# EAGLE design V1_7_7 (EAGLE 8.3.2)
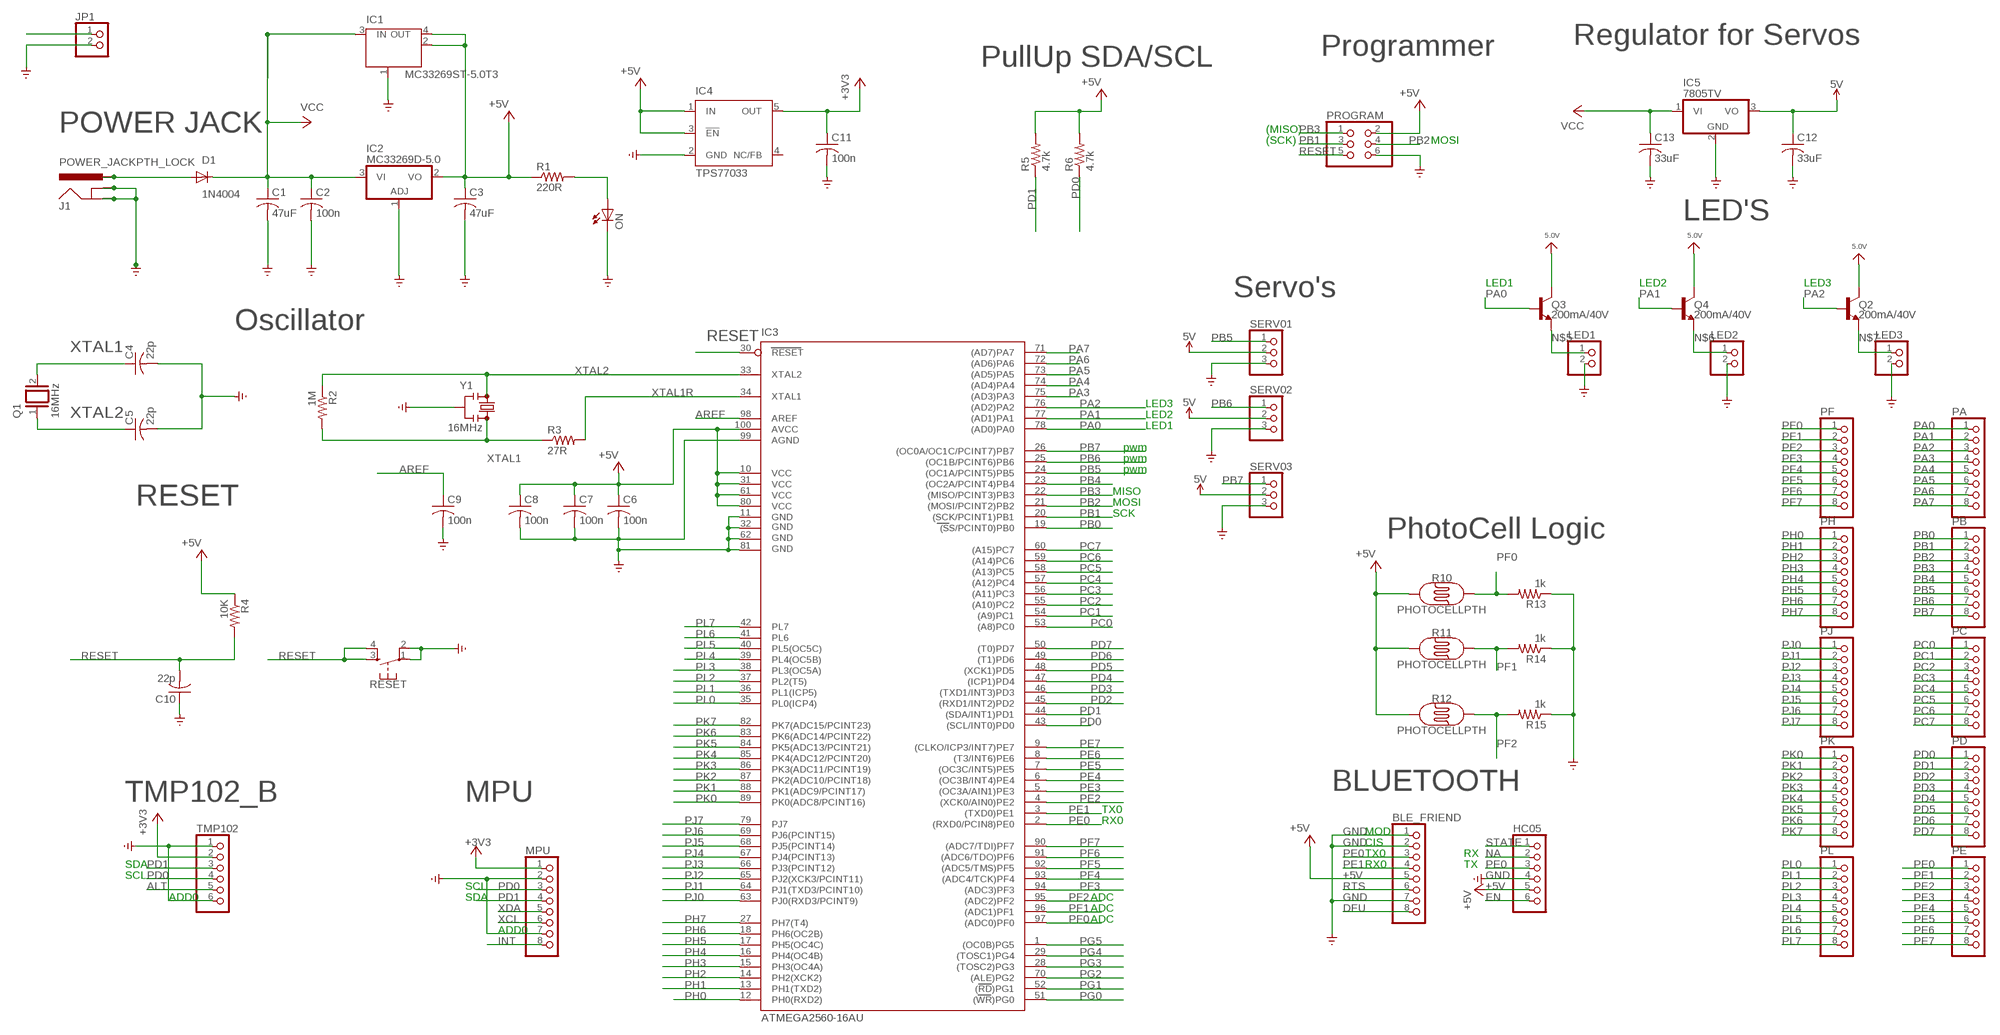
[diagram p0: schematic, sheet 1, part 1 of 2]
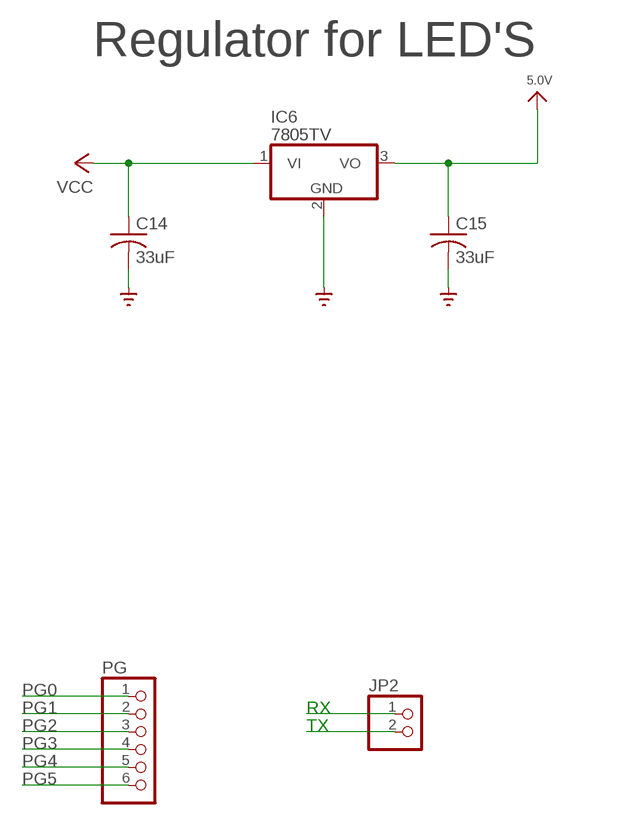
[diagram p1: schematic, sheet 1, part 2 of 2]

## Parts
BLE_FRIEND  PINHD-1X8  [1X08]
C1  47uF  C-US025-024X044  [C025-024X044]
C2  100n  C-US025-024X044  [C025-024X044]
C3  47uF  C-US025-024X044  [C025-024X044]
C4  22p  C-US025-024X044  [C025-024X044]
C5  22p  C-US025-024X044  [C025-024X044]
C6  100n  C-US025-024X044  [C025-024X044]
C7  100n  C-US025-024X044  [C025-024X044]
C8  100n  C-US025-024X044  [C025-024X044]
C9  100n  C-US025-024X044  [C025-024X044]
C10  22p  C-US025-024X044  [C025-024X044]
C11  100n  C-US025-024X044  [C025-024X044]
C12  33uF  C-US025-024X044  [C025-024X044]
C13  33uF  C-US025-024X044  [C025-024X044]
C14  33uF  C-US025-024X044  [C025-024X044]
C15  33uF  C-US025-024X044  [C025-024X044]
D1  1N4004  [DO41-10]
HC05  PINHD-1X6  [1X06]
IC1  MC33269ST-5.0T3  MC33269ST-3.3T3  [SOT223]
IC2  MC33269D-5.0  [DPACK]
IC3  ATMEGA2560-16AU  [TQFP100]
IC4  TPS77033  [SOT23-DBV]
IC5  7805TV  [TO220V]
IC6  7805TV  [TO220V]
J1  POWER_JACKPTH_LOCK  [POWER_JACK_PTH_LOCK]
JP1  PINHD-1X2  [1X02]
JP2  PINHD-1X2  [1X02]
LED1  PINHD-1X2  [1X02]
LED2  PINHD-1X2  [1X02]
LED3  PINHD-1X2  [1X02]
MPU  PINHD-1X8  [1X08]
ON  LED3MM  [LED3MM]
PA  PINHD-1X8  [1X08]
PB  PINHD-1X8  [1X08]
PC  PINHD-1X8  [1X08]
PD  PINHD-1X8  [1X08]
PE  PINHD-1X8  [1X08]
PF  PINHD-1X8  [1X08]
PG  PINHD-1X6  [1X06]
PH  PINHD-1X8  [1X08]
PJ  PINHD-1X8  [1X08]
PK  PINHD-1X8  [1X08]
PL  PINHD-1X8  [1X08]
PROGRAM  PINHD-2X3  [2X03]
Q1  16MHz  XTAL/S  [QS]
Q2  200mA/40V  TRANS_NPN-2N3904  [TO-92]
Q3  200mA/40V  TRANS_NPN-2N3904  [TO-92]
Q4  200mA/40V  TRANS_NPN-2N3904  [TO-92]
R1  220R  R-US_0204/2V  [0204V]
R2  1M  R-US_0204/2V  [0204V]
R3  27R  R-US_0204/2V  [0204V]
R4  10K  R-US_0204/2V  [0204V]
R5  4.7k  R-US_0204/2V  [0204V]
R6  4.7k  R-US_0204/2V  [0204V]
R10  PHOTOCELLPTH  [PHOTOCELL]
R11  PHOTOCELLPTH  [PHOTOCELL]
R12  PHOTOCELLPTH  [PHOTOCELL]
R13  1k  R-US_0204/2V  [0204V]
R14  1k  R-US_0204/2V  [0204V]
R15  1k  R-US_0204/2V  [0204V]
RESET  MOMENTARY-SWITCH-SPST-2-SMD-5.2MM  [TACTILE_SWITCH_SMD_5.2MM]
SERV01  PINHD-1X3  [1X03]
SERV02  PINHD-1X3  [1X03]
SERV03  PINHD-1X3  [1X03]
TMP102  PINHD-1X6  [1X06]
Y1  16MHz  RESONATORSMD-3.2X1.3  [RESONATOR-SMD-3.2X1.3]

## Nets
5.0V: C15.1 IC6.3(VO) Q2.3(C) Q3.3(C) Q4.3(C)
5V: C12.1 IC5.3(VO) SERV01.2 SERV02.2 SERV03.2
+3V3: C11.1 IC4.5(OUT) MPU.1 TMP102.2
+5V: BLE_FRIEND.5 C3.1 C6.1 C7.1 C8.1 HC05.5 IC1.2(OUT) IC1.4(OUT) IC2.2(VO) IC3.10(VCC) IC3.31(VCC1) IC3.61(VCC2) IC3.80(VCC3) IC3.100(AVCC) IC4.1(IN) IC4.3(!EN) PROGRAM.2 R1.1 R4.1 R5.2 R6.2 R10.1 R11.1 R12.1
ALT: TMP102.5
AREF: C9.1 IC3.98(AREF)
DFU: BLE_FRIEND.8
EN: HC05.6
GND: BLE_FRIEND.1 BLE_FRIEND.2 BLE_FRIEND.7 C1.2 C2.2 C3.2 C4.2 C5.2 C6.2 C7.2 C8.2 C9.2 C10.1 C11.2 C12.2 C13.2 C14.2 C15.2 HC05.4 IC1.1(GND/ADJ) IC2.1(ADJ) IC3.11(GND) IC3.32(GND1) IC3.62(GND2) IC3.81(GND3) IC3.99(AGND) IC4.2(GND) IC5.2(GND) IC6.2(GND) J1.GND J1.GNDBREAK JP1.2 LED1.2 LED2.2 LED3.2 MPU.2 MPU.7 ON.K(C) PROGRAM.6 R13.1 R14.1 R15.1 RESET.1 RESET.2 SERV01.3 SERV02.3 SERV03.3 TMP102.1 TMP102.6 Y1.2 ; supply symbol labelled GND_
INT: MPU.8
N$3: ON.A R1.2
N$5: LED1.1 Q3.1(E)
N$6: LED2.1 Q4.1(E)
N$7: LED3.1 Q2.1(E)
NA: HC05.2
PA0: IC3.78((AD0)PA0) PA.1 Q3.2(B)
PA1: IC3.77((AD1)PA1) PA.2 Q4.2(B)
PA2: IC3.76((AD2)PA2) PA.3 Q2.2(B)
PA3: IC3.75((AD3)PA3) PA.4
PA4: IC3.74((AD4)PA4) PA.5
PA5: IC3.73((AD5)PA5) PA.6
PA6: IC3.72((AD6)PA6) PA.7
PA7: IC3.71((AD7)PA7) PA.8
PB0: IC3.19((SS/PCINT0)PB0) PB.1
PB1: IC3.20((SCK/PCINT1)PB1) PB.2 PROGRAM.3
PB2: IC3.21((MOSI/PCINT2)PB2) PB.3 PROGRAM.4
PB3: IC3.22((MISO/PCINT3)PB3) PB.4 PROGRAM.1
PB4: IC3.23((OC2A/PCINT4)PB4) PB.5
PB5: IC3.24((OC1A/PCINT5)PB5) PB.6 SERV01.1
PB6: IC3.25((OC1B/PCINT6)PB6) PB.7 SERV02.1
PB7: IC3.26((OC0A/OC1C/PCINT7)PB7) PB.8 SERV03.1
PC0: IC3.53((A8)PC0) PC.1
PC1: IC3.54((A9)PC1) PC.2
PC2: IC3.55((A10)PC2) PC.3
PC3: IC3.56((A11)PC3) PC.4
PC4: IC3.57((A12)PC4) PC.5
PC5: IC3.58((A13)PC5) PC.6
PC6: IC3.59((A14)PC6) PC.7
PC7: IC3.60((A15)PC7) PC.8
PD0: IC3.43((SCL/INT0)PD0) MPU.3 PD.1 R6.1 TMP102.4
PD1: IC3.44((SDA/INT1)PD1) MPU.4 PD.2 R5.1 TMP102.3
PD2: IC3.45((RXD1/INT2)PD2) PD.3
PD3: IC3.46((TXD1/INT3)PD3) PD.4
PD4: IC3.47((ICP1)PD4) PD.5
PD5: IC3.48((XCK1)PD5) PD.6
PD6: IC3.49((T1)PD6) PD.7
PD7: IC3.50((T0)PD7) PD.8
PE0: BLE_FRIEND.3 HC05.3 IC3.2((RXD0/PCIN8)PE0) JP2.1 PE.1
PE1: BLE_FRIEND.4 IC3.3((TXD0)PE1) JP2.2 PE.2
PE2: IC3.4((XCK0/AIN0)PE2) PE.3
PE3: IC3.5((OC3A/AIN1)PE3) PE.4
PE4: IC3.6((OC3B/INT4)PE4) PE.5
PE5: IC3.7((OC3C/INT5)PE5) PE.6
PE6: IC3.8((T3/INT6)PE6) PE.7
PE7: IC3.9((CLKO/ICP3/INT7)PE7) PE.8
PF0: IC3.97((ADC0)PF0) PF.1 R10.2 R13.2
PF1: IC3.96((ADC1)PF1) PF.2 R11.2 R14.2
PF2: IC3.95((ADC2)PF2) PF.3 R12.2 R15.2
PF3: IC3.94((ADC3)PF3) PF.4
PF4: IC3.93((ADC4/TCK)PF4) PF.5
PF5: IC3.92((ADC5/TMS)PF5) PF.6
PF6: IC3.91((ADC6/TDO)PF6) PF.7
PF7: IC3.90((ADC7/TDI)PF7) PF.8
PG0: IC3.51((WR)PG0) PG.1
PG1: IC3.52((RD)PG1) PG.2
PG2: IC3.70((ALE)PG2) PG.3
PG3: IC3.28((TOSC2)PG3) PG.4
PG4: IC3.29((TOSC1)PG4) PG.5
PG5: IC3.1((OC0B)PG5) PG.6
PH0: IC3.12(PH0(RXD2)) PH.1
PH1: IC3.13(PH1(TXD2)) PH.2
PH2: IC3.14(PH2(XCK2)) PH.3
PH3: IC3.15(PH3(OC4A)) PH.4
PH4: IC3.16(PH4(OC4B)) PH.5
PH5: IC3.17(PH5(OC4C)) PH.6
PH6: IC3.18(PH6(OC2B)) PH.7
PH7: IC3.27(PH7(T4)) PH.8
PJ0: IC3.63(PJ0(RXD3/PCINT9)) PJ.1
PJ1: IC3.64(PJ1(TXD3/PCINT10)) PJ.2
PJ2: IC3.65(PJ2(XCK3/PCINT11)) PJ.3
PJ3: IC3.66(PJ3(PCINT12)) PJ.4
PJ4: IC3.67(PJ4(PCINT13)) PJ.5
PJ5: IC3.68(PJ5(PCINT14)) PJ.6
PJ6: IC3.69(PJ6(PCINT15)) PJ.7
PJ7: IC3.79(PJ7) PJ.8
PK0: IC3.89(PK0(ADC8/PCINT16)) PK.1
PK1: IC3.88(PK1(ADC9/PCINT17)) PK.2
PK2: IC3.87(PK2(ADC10/PCINT18)) PK.3
PK3: IC3.86(PK3(ADC11/PCINT19)) PK.4
PK4: IC3.85(PK4(ADC12/PCINT20)) PK.5
PK5: IC3.84(PK5(ADC13/PCINT21)) PK.6
PK6: IC3.83(PK6(ADC14/PCINT22)) PK.7
PK7: IC3.82(PK7(ADC15/PCINT23)) PK.8
PL0: IC3.35(PL0(ICP4)) PL.1
PL1: IC3.36(PL1(ICP5)) PL.2
PL2: IC3.37(PL2(T5)) PL.3
PL3: IC3.38(PL3(OC5A)) PL.4
PL4: IC3.39(PL4(OC5B)) PL.5
PL5: IC3.40(PL5(OC5C)) PL.6
PL6: IC3.41(PL6) PL.7
PL7: IC3.42(PL7) PL.8
POWERIN: D1.A J1.PWR JP1.1
RESET: C10.2 IC3.30(RESET) PROGRAM.5 R4.2 RESET.3 RESET.4
RTS: BLE_FRIEND.6
STATE: HC05.1
VCC: C1.1 C2.1 C13.1 C14.1 D1.C IC1.3(IN) IC2.3(VI) IC5.1(VI) IC6.1(VI)
XCL: MPU.6
XDA: MPU.5
XTAL1: C4.1 Q1.2 R2.2 R3.1 Y1.3
XTAL1R: IC3.34(XTAL1) R3.2
XTAL2: C5.1 IC3.33(XTAL2) Q1.1 R2.1 Y1.1
Unconnected: IC4.4(NC/FB)

## Notes on the sheet
- Regulator for Servos | Regulator for LED'S
- Programmer
- PullUp SDA/SCL
- POWER JACK | (MISO)
- (SCK) | MOSI
- LED'S
- LED1 | LED2 | LED3
- Servo's
- Oscillator
- LED3
- LED2
- LED1
- pwm | RX
- pwm | TX
- pwm
- MISO
- RESET | MOSI
- SCK
- PhotoCell Logic
- BLUETOOTH
- TMP102_B | MPU
- TX0
- RX0
- MOD
- CIS
- TX0 | RX
- SDA | RX0 | TX
- SCL
- SCL
- ADD0 | SDA | ADC
- ADC
- ADC
- ADD0

## Library data of the parts
BLE_FRIEND MPU PA PB PC PD PE PF PH PJ PK PL = pinhead:PINHD-1X8: PIN HEADER
C1-C15 = adafruit:C-US: CAPACITOR, American symbol
D1 = adafruit:1N4004: DIODE General purpose 1N400x type rectifier (With bigger pads) http://www.ladyada.net/library/pcb/eaglelibrary.html
HC05 = pinhead@1:PINHD-1X6: PIN HEADER
IC1 = linear:MC33269ST*: Adjustable Output Low Dropout Voltage Regulator 800 mA Source: http://www.onsemi.com/pub/Collateral/MC33269-D.PDF
IC2 = linear:MC33269?*: Adjustable Output Low Dropout Voltage Regulator 800 mA Source: http://www.onsemi.com/pub/Collateral/MC33269-D.PDF
IC3 = atmel-2005:ATMEGA*: MICROCONTROLLER 64/128/256 Kbytes FLASH 4 Kbytes EEPROM 8 Kbytes SRAM 86 General Purpose I/O pins 12-channels16-bit PWM 4 x Serial USARTs 16-channels 10-bit A/D
IC4 = texas:TPS770*: ULTRALOW-POWER 50-mA LOW-DROPOUT LINEAR REGULATORS 50-mA Low-Dropout Regulator Source: http://focus.ti.com/lit/ds/symlink/tps77001.pdf; MF: TEXAS INSTRUMENTS; MPN: TPS77033DBVT; OC_FARNELL: 8461570; OC_NEWARK: 77C1187
IC5 IC6 = linear:78*: Positive VOLTAGE REGULATOR Source: http://cache.national.com/ds/LM/LM78L05.pdf http://www.fairchildsemi.com/ds/LM/LM7805.pdf
J1 = SparkFun-Connectors:POWER_JACK: Power Jack Connector This is the standard 5.5mm barrel jack for power. The PTH is the most common, proven, reliable, footprint. The Slot footprint only works if the mill layer is transmitted to the PCB fab house so be warned. Here are the connectors we sell at SparkFun: DC Barrel Power Jack/Connector <https://www.sparkfun.com/products/119> (PRT-00119) DC Barrel Power Jack/Connector (SMD) <https://www.sparkfun.com/products/12748> (PRT-12748) DC Barrel Jack Adapter - Breadboard Compatible <https://www.sparkfun.com/products/10811> (PRT-10811) It is used on this SparkFun product (and many, many others): SparkFun RedBoard - Programmed with Arduino <https://www.sparkfun.com/products/12757> (DEV-12757) Also, if you need a mating power supply or connector, please check these out: Wall Adapter Power Supply - 9VDC 650mA <https://www.sparkfun.com/products/298> (TOL-00298) DC Barrel Jack Adapter - Male <https://www.sparkfun.com/products/10287> (PRT-10287); PROD_ID: CONN-08197; SF_ID: PRT-00119
JP1 LED1-LED3 = pinhead:PINHD-1X2: PIN HEADER
JP2 = pinhead@1:PINHD-1X2: PIN HEADER
ON = adafruit:LED: LED OSRAM: - CHIPLED LG R971, LG N971, LY N971, LG Q971, LY Q971, LO R971, LY R971 LH N974, LH R974 LS Q976, LO Q976, LY Q976 LO Q996 - Hyper CHIPLED LW Q18S LB Q993, LB Q99A, LB R99A - SideLED LS A670, LO A670, LY A670, LG A670, LP A670 LB A673, LV A673, LT A673, LW A673 LH A674 LY A675 LS A676, LA A676, LO A676, LY A676, LW A676 LS A679, LY A679, LG A679 - Hyper Micro SIDELED® LS Y876, LA Y876, LO Y876, LY Y876 LT Y87S - SmartLED LW L88C, LW L88S LB L89C, LB L89S, LG L890 LS L89K, LO L89K, LY L89K LS L896, LA L896, LO L896, LY L896 - TOPLED LS T670, LO T670, LY T670, LG T670, LP T670 LSG T670, LSP T670, LSY T670, LOP T670, LYG T670 LG T671, LOG T671, LSG T671 LB T673, LV T673, LT T673, LW T673 LH T674 LS T676, LA T676, LO T676, LY T676, LB T676, LH T676, LSB T676, LW T676 LB T67C, LV T67C, LT T67C, LS T67K, LO T67K, LY T67K, LW E67C LS E67B, LA E67B, LO E67B, LY E67B, LB E67C, LV E67C, LT E67C LW T67C LS T679, LY T679, LG T679 LS T770, LO T770, LY T770, LG T770, LP T770 LB T773, LV T773, LT T773, LW T773 LH T774 LS E675, LA E675, LY E675, LS T675 LS T776, LA T776, LO T776, LY T776, LB T776 LHGB T686 LT T68C, LB T68C - Hyper Mini TOPLED® LB M676 - Mini TOPLED Santana® LG M470 LS M47K, LO M47K, LY M47K Source: http://www.osram.convergy.de/
PG TMP102 = pinhead:PINHD-1X6: PIN HEADER
PROGRAM = pinhead:PINHD-2X3: PIN HEADER
Q1 = special:XTAL/S: CRYSTAL
Q2-Q4 = SparkFun-DiscreteSemi:TRANS_NPN: NPN transistor Current controlled devices typically used to amplify current or used as a switch. BC547 - COM-08928 <http://www.sparkfun.com/products/8928> (TO-92 45V 100mA) (1.Collector 2.Base 3.Emitter) 2N3904 - COM-00521 <http://www.sparkfun.com/products/521> (TO-92 40V 200mA) (1.Emitter 2.Base 3.Collector) P2N2222A - COM-12852 <http://www.sparkfun.com/products/12852> (TO-92 40V 600mA) (1.Collector 2.Base 3.Emitter); PROD_ID: TRANS-08447
R1-R6 R13-R15 = resistor:R-US_: RESISTOR, American symbol
R10-R12 = SparkFun-Sensors:PHOTOCELL: Photocell (Photodetector, Photo Resistor, CdS) This is a very small light sensor. A photocell changes (also called a photodetector, photo resistor, CdS or photoconductive cell) resistance depending on the amount of light it is exposed to. These little sensors make great ambient light triggers (when light in the room turns on, do something). Datasheet <http://cdn.sparkfun.com/datasheets/Sensors/LightImaging/SEN-09088.pdf> SparkFun Products Mini Photocell <https://www.sparkfun.com/products/9088> (SEN-09088); PROD_ID: COMP-09129; SF_ID: SEN-09088
RESET = SparkFun-Switches:MOMENTARY-SWITCH-SPST-2: Momentary Switch (Pushbutton) - SPST - Two Circuits Normally-open (NO) SPST momentary switches (buttons, pushbuttons). Schematic symbol includes two switch circuits. Variants SMD-4.6MMX2.8MM - 4.60mm x 2.80mm Tactile Momentary Button Switch - Used on SparkFun SAMD21 Mini Breakout <https://www.sparkfun.com/products/13664> SMD-5.2MM - Mini Pushbutton Switch - SMD <https://www.sparkfun.com/products/8720> - Used on Arduino Pro Mini <https://www.sparkfun.com/products/11114>; PROD_ID: SWCH-08247; SF_SKU: COM-08720
SERV01-SERV03 = pinhead:PINHD-1X3: PIN HEADER
Y1 = SparkFun-Clocks:RESONATOR: Resonators (Generic) Ceramic resonators are clock-generating components, often used to control timing in microcontrollers. They usually have 3 pins: two pins for oscillation, and one pin for ground. Compared to crystals, resonators have worse tolerance, but are usually much cheaper. Plus, they have built-in load capacitors! These devices are used on boards like the Arduino Pro 8MHz <https://www.sparkfun.com/products/11114> and Arduino Pro 16MHz <https://www.sparkfun.com/products/11113>.

## Net classes
0 default: width 0.15 mm, drill 0.3 mm, clearance 0.15 mm

## Board
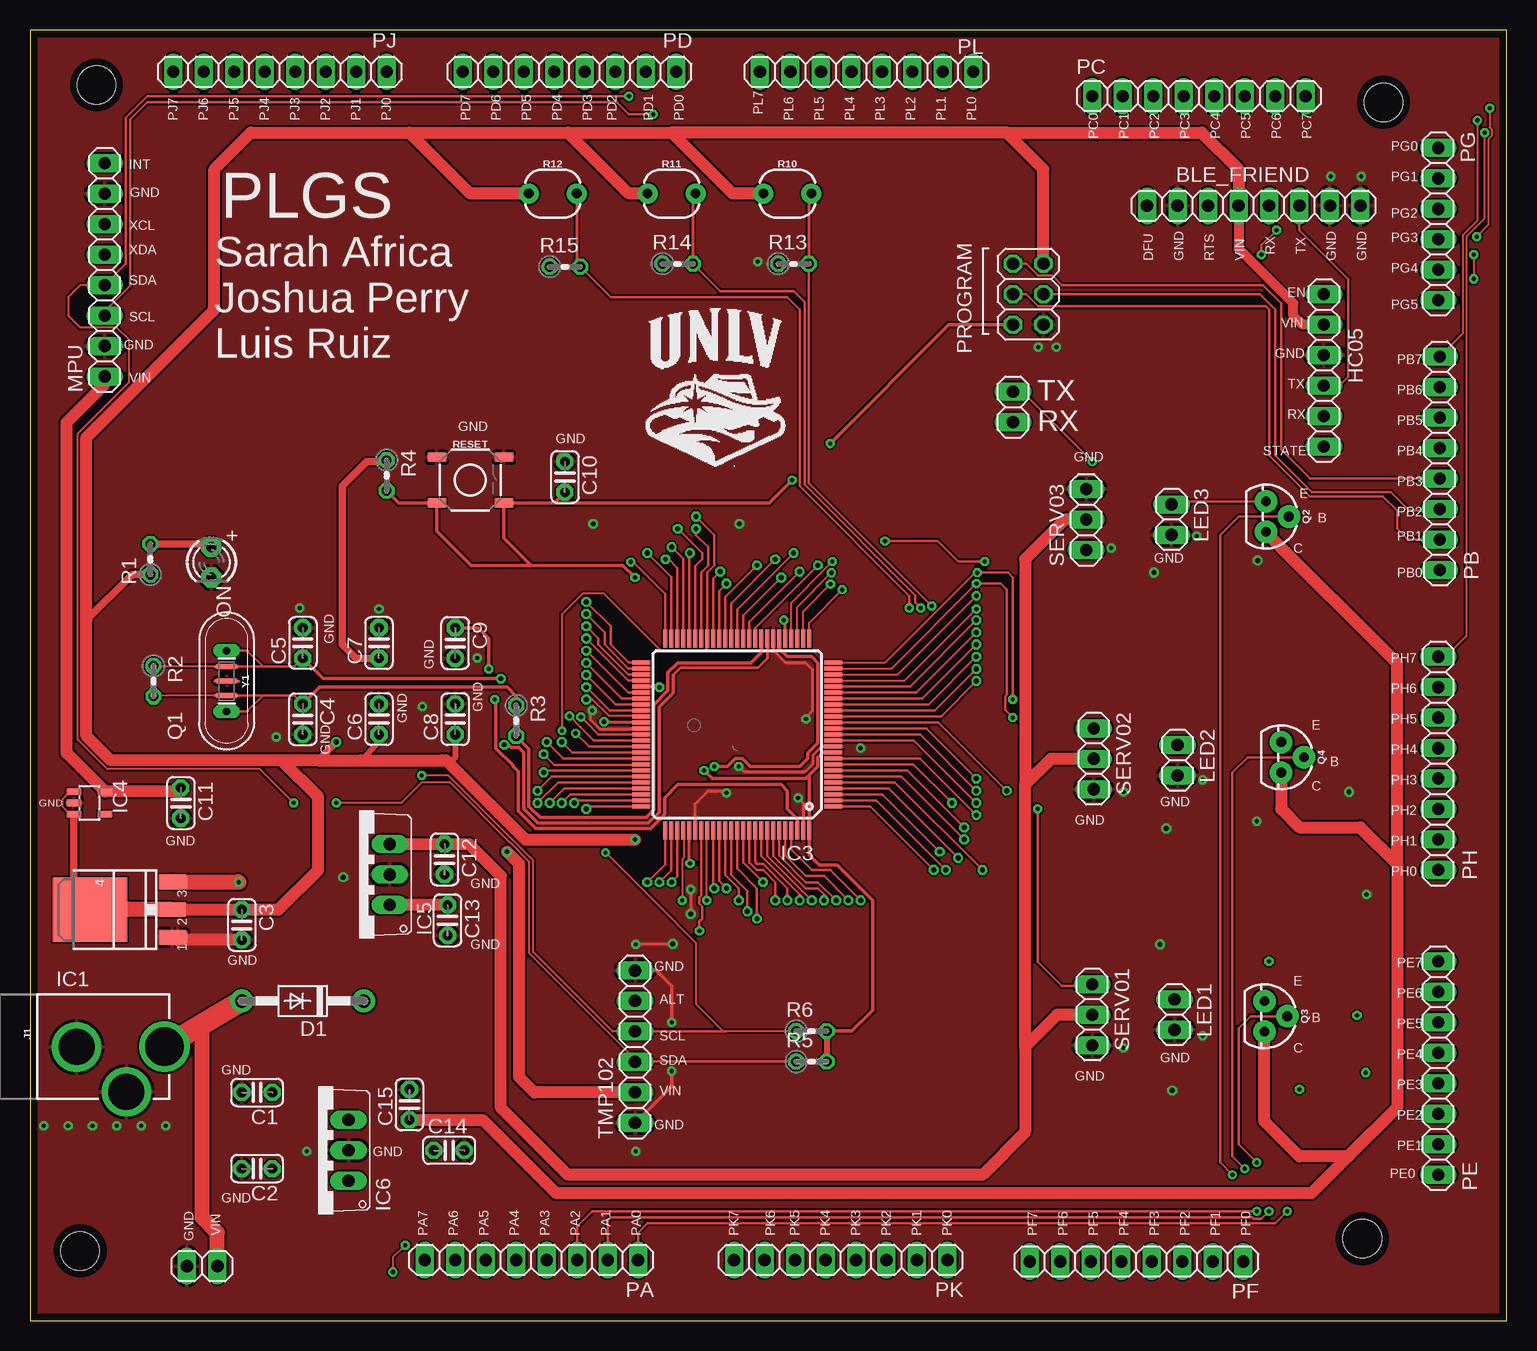
[diagram p2: board, top side]
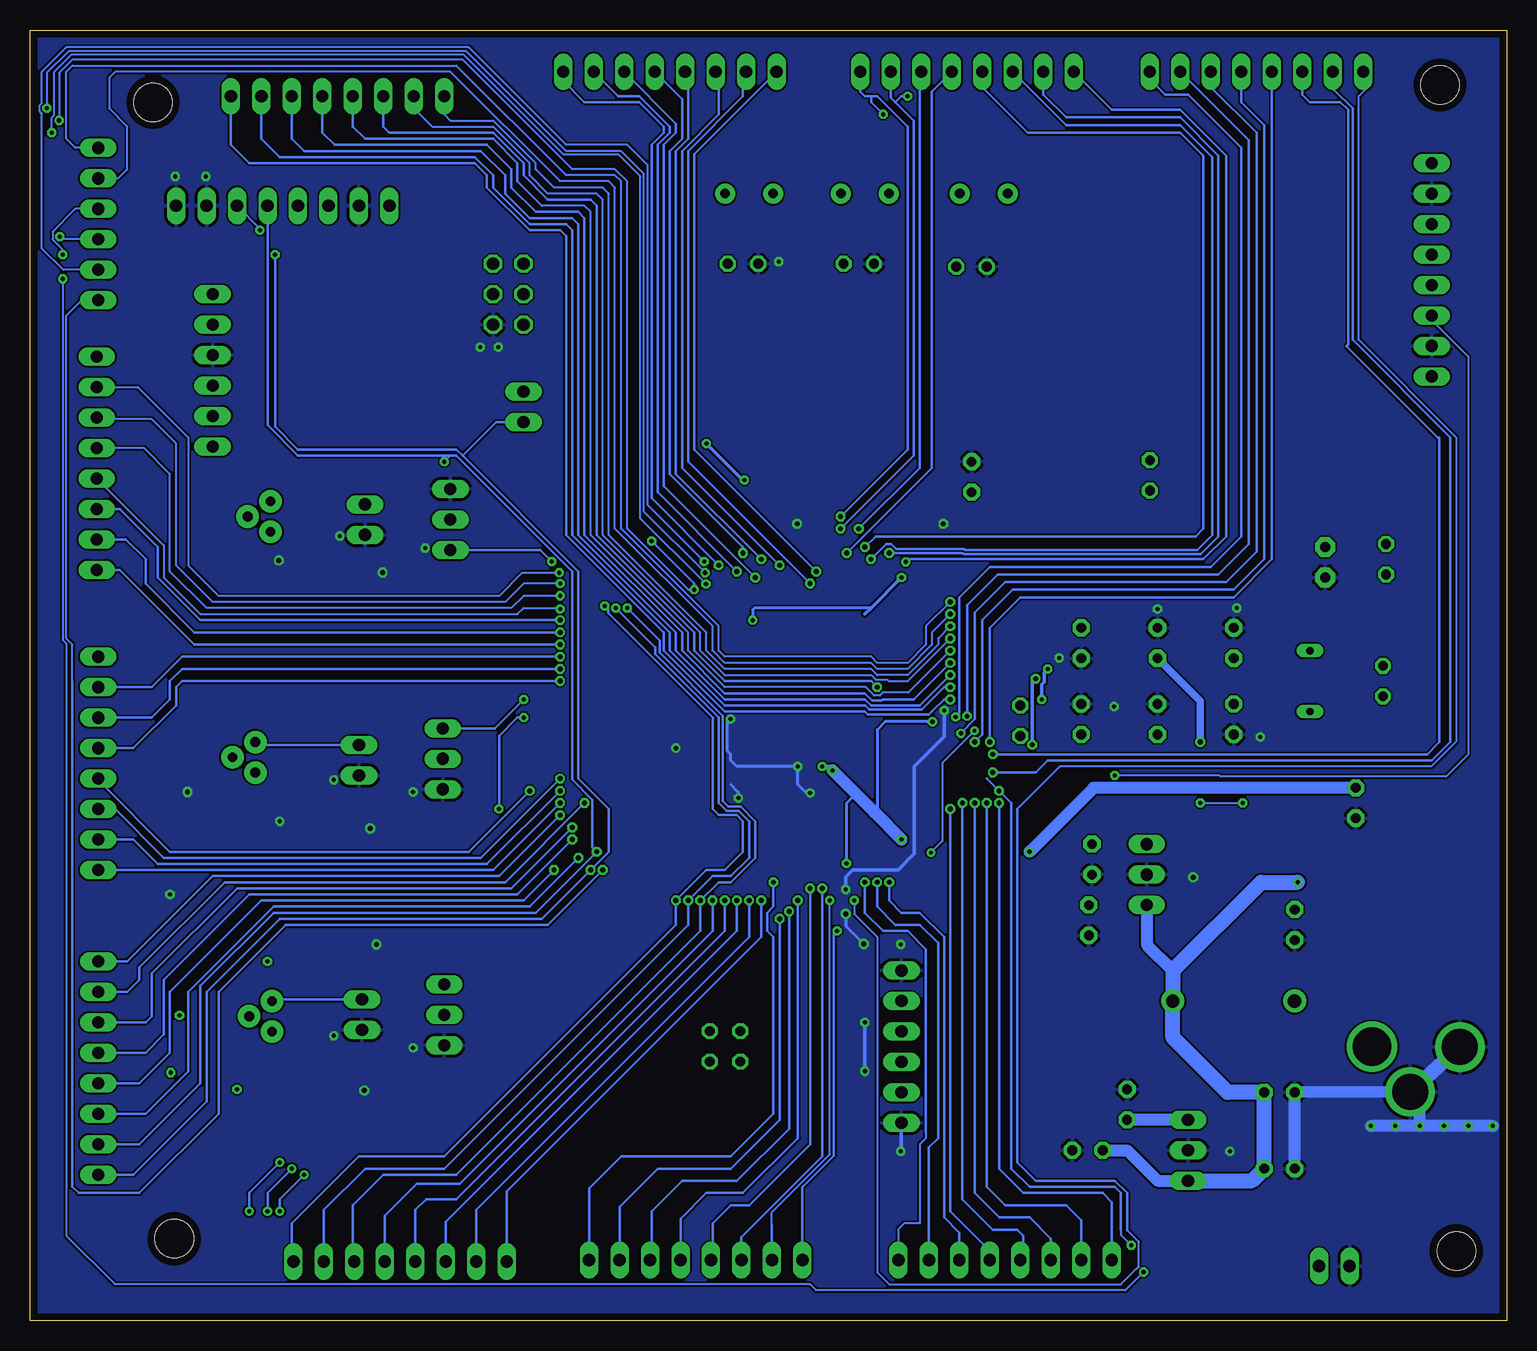
[diagram p3: board, bottom side, seen from below]

Size 123.04 x 107.62 mm. Coordinates in mm from the lower left corner, seen from the top.
Outline: 0,0 123.04,0 123.04,107.62 0,107.62 0,0
Copper layers (1*16): Top 0.035mm / dielectric 1.5mm / Bottom 0.035mm
Design rules "default *": minimum track width 0.15mm, minimum drill 0.3mm, track to track 0.15mm, track to pad 0.15mm, pad to pad 0.15mm, via to via 0.15mm, smd to smd 0.15mm, copper to edge 0.6mm, drill to drill 0.3mm, minimum pad ring 10mil, minimum via ring 8mil, stop-mask expansion 2mil, vias tented up to drill 0mil, thermal gap 10mil
Holes 3.2 mm at 5.54,103.03 112.8,101.59 111.02,6.86 4.18,5.84

### Footprints (pad centres in the part's own frame; a part is rotated, then mirrored left to right if it is on the bottom)
1X08 = drill 1.016 long: 1 -8.89,0; 2 -6.35,0; 3 -3.81,0; 4 -1.27,0; 5 1.27,0; 6 3.81,0; 7 6.35,0; 8 8.89,0
C025-024X044 = drill 0.813 pad 1.422 octagon: 1 -1.27,0; 2 1.27,0
DO41-10 = drill 1.118 pad 1.93: A 5.08,0; C -5.08,0
1X06 = drill 1.016 long: 1 -6.35,0; 2 -3.81,0; 3 -1.27,0; 4 1.27,0; 5 3.81,0; 6 6.35,0
SOT223 = smd 1.219 x 2.235: 1 -2.311,-3.099; 2 0,-3.099; 3 2.311,-3.099 | smd 3.6 x 2.2: 4 0,3.099
DPACK = smd 1 x 1.6: 1 -2.28,-4.8; 3 2.28,-4.8 | smd 5.4 x 6.2: 2 0,2.5
TQFP100 = smd 1.5 x 0.35: 1 -8,6; 2 -8,5.5; 3 -8,5; 4 -8,4.5; 5 -8,4; 6 -8,3.5; 7 -8,3; 8 -8,2.5; 9 -8,2; 10 -8,1.5; 11 -8,1; 12 -8,0.5; 13 -8,0; 14 -8,-0.5; 15 -8,-1; 16 -8,-1.5; 17 -8,-2; 18 -8,-2.5; 19 -8,-3; 20 -8,-3.5; 21 -8,-4; 22 -8,-4.5; 23 -8,-5; 24 -8,-5.5; 25 -8,-6; 51 8,-6; 52 8,-5.5; 53 8,-5; 54 8,-4.5; 55 8,-4; 56 8,-3.5; 57 8,-3; 58 8,-2.5; 59 8,-2; 60 8,-1.5; 61 8,-1; 62 8,-0.5; 63 8,0; 64 8,0.5; 65 8,1; 66 8,1.5; 67 8,2; 68 8,2.5; 69 8,3; 70 8,3.5; 71 8,4; 72 8,4.5; 73 8,5; 74 8,5.5; 75 8,6 | smd 0.35 x 1.5: 26 -6,-8; 27 -5.5,-8; 28 -5,-8; 29 -4.5,-8; 30 -4,-8; 31 -3.5,-8; 32 -3,-8; 33 -2.5,-8; 34 -2,-8; 35 -1.5,-8; 36 -1,-8; 37 -0.5,-8; 38 0,-8; 39 0.5,-8; 40 1,-8; 41 1.5,-8; 42 2,-8; 43 2.5,-8; 44 3,-8; 45 3.5,-8; 46 4,-8; 47 4.5,-8; 48 5,-8; 49 5.5,-8; 50 6,-8; 76 6,8; 77 5.5,8; 78 5,8; 79 4.5,8; 80 4,8; 81 3.5,8; 82 3,8; 83 2.5,8; 84 2,8; 85 1.5,8; 86 1,8; 87 0.5,8; 88 0,8; 89 -0.5,8; 90 -1,8; 91 -1.5,8; 92 -2,8; 93 -2.5,8; 94 -3,8; 95 -3.5,8; 96 -4,8; 97 -4.5,8; 98 -5,8; 99 -5.5,8; 100 -6,8
SOT23-DBV = smd 0.55 x 1.2: 1 -0.95,-1.3; 2 0,-1.3; 3 0.95,-1.3; 4 0.95,1.3; 5 -0.95,1.3
TO220V = drill 1.016 long: 1 -2.54,-2.54; 2 0,-2.54; 3 2.54,-2.54
POWER_JACK_PTH_LOCK = drill 2.997 pad 4.115: GND 0.025,6.557; GNDBREAK 3.762,10.7 | drill 3.2 pad 4.115: PWR 0,13.878
1X02 = drill 1.016 long: 1 -1.27,0; 2 1.27,0
LED3MM = drill 0.813 pad 1.676 octagon: A -1.27,0; K 1.27,0
2X03 = drill 1.016 octagon: 1 -2.54,-1.27; 2 -2.54,1.27; 3 0,-1.27; 4 0,1.27; 5 2.54,-1.27; 6 2.54,1.27
QS = drill 0.61 long: 1 -2.54,0; 2 2.54,0
TO-92 = drill 0.813 pad 1.88: 1 -1.27,0; 2 0,1.905; 3 1.27,0
0204V = drill 0.813 octagon: 1 -1.27,0; 2 1.27,0
PHOTOCELL = drill 0.8 pad 1.676: 1 -2,0; 2 2,0
TACTILE_SWITCH_SMD_5.2MM = smd 1.524 x 0.762: 1 -2.794,1.905; 2 2.794,1.905; 3 -2.794,-1.905; 4 2.794,-1.905
1X03 = drill 1.016 long: 1 -2.54,0; 2 0,0; 3 2.54,0
RESONATOR-SMD-3.2X1.3 = smd 0.45 x 1.905: 1 -1.2,0; 2 0,0; 3 1.2,0

### Placement (x,y rotation side)
BLE_FRIEND  101.98,92.96 180 top
C1  18.92,19.05 180 top
C2  18.92,12.7 180 top
C3  17.65,33.02 270 top
C4  22.73,50.16 270 top
C5  22.73,56.52 90 top
C6  29.08,50.16 90 top
C7  29.08,56.52 90 top
C8  35.43,50.16 90 top
C9  35.43,56.52 270 top
C10  44.58,70.36 270 top
C11  12.57,43.18 270 top
C12  34.54,38.48 270 top
C13  34.8,33.4 270 top
C14  34.92,14.22 0 top
C15  31.62,18.03 90 top
D1  22.73,26.67 180 top
HC05  107.82,79.25 90 top
IC1  8.76,34.29 90 top
IC2  7.49,34.29 90 top
IC3  58.93,48.9 180 top
IC4  4.95,43.18 270 top
IC5  27.43,37.21 90 top
IC6  24,14.22 90 top
J1  -2.67,22.86 270 top
JP1  14.35,4.57 180 top
JP2  81.91,76.2 90 top
LED1  95.38,25.53 270 top
LED2  95.63,46.74 270 top
LED3  95.12,66.8 270 top
MPU  6.22,87.63 90 top
ON  15.11,63.25 270 top
PA  41.78,5.08 180 top
PB  117.47,71.5 90 top
PC  97.41,102.11 0 top
PD  44.96,104.14 180 top
PE  117.35,21.08 90 top
PF  92.2,4.95 180 top
PG  117.35,91.44 270 top
PH  117.35,46.48 90 top
PJ  20.83,104.14 180 top
PK  67.56,5.08 180 top
PL  69.72,104.14 180 top
PROGRAM  83.19,85.6 270 top
Q1  16.38,53.34 270 top
Q2  103,67.06 270 top
Q3  102.87,25.4 270 top
Q4  104.27,46.99 270 top
R1  10.03,63.5 90 top
R2  10.29,53.34 270 top
R3  40.51,50.04 270 top
R4  29.72,70.48 270 top
R5  65.12,21.62 0 top
R6  65.12,24.16 0 top
R10  63.12,93.98 0 top
R11  53.47,93.98 0 top
R12  43.56,93.98 0 top
R13  63.63,88.14 0 top
R14  53.98,88.14 0 top
R15  44.58,87.88 0 top
RESET  36.7,70.1 0 top
SERV01  88.52,25.53 270 top
SERV02  88.65,46.86 270 top
SERV03  88.01,66.8 90 top
TMP102  50.42,22.86 90 top
Y1  16.38,53.34 270 top

### Tracks (layer width: path | path; a pad name or v marks a point on that pad's centre or on a via)
5.0V
  Top 1.016: C15.1 37.72,16.76 43.81,10.67 106.81,10.67 109.86,13.72 | 109.86,13.72 113.92,17.78 113.92,38.1 | 113.92,38.1 113.92,54.86 Q2.3 | Q4.3 104.27,42.67 105.79,41.15 110.87,41.15 113.92,38.1 | 109.86,13.72 105.79,13.72 102.87,16.64 Q3.3
  Bottom 1.016: IC6.3 C15.1
5V
  Top 1.016: IC5.3 C12.1 36.58,39.75 39.24,37.08 39.24,17.78 44.83,12.19 79.38,12.19 82.93,15.75 82.93,22.86 | 82.93,44.7 82.93,63.5 86.23,66.8 SERV03.2 | 82.93,22.86 82.93,44.7 | SERV02.2 85.09,46.86 82.93,44.7 | SERV01.2 85.6,25.53 82.93,22.86
+3V3  (via drill 0.35)
  Top 1.016: MPU.1 6.22,78.11 3.05,74.93 3.05,47.34 IC4.5 12.25,44.13 C11.1 | 50.17,18.8 TMP102.2 42.04,19.05 40.77,20.32 40.77,38.1 v39.75,39.12
  Bottom 1.016: C11.1 34.42,44.45 v39.75,39.12
+5V  (via drill 0.35, 0.41)
  Top 0.15: IC4.1 3.52,43.97 3.21,43.97 2.73,43.5 2.73,42.86 3.37,42.23 IC4.3 | IC2.2 IC1.4 | 34.32,46.74 34.32,46.83 34.67,46.74 | IC3.100 64.96,40.96 64.96,41.59 64.91,41.66
  Top 0.152: v55,38.13 54.93,38.2
  Top 0.254: 54.93,38.2 IC3.80 | IC3.61 47.89,49.9 v47.83,49.95 | 65.15,45.72 64.93,45.5 64.93,45.21
  Top 0.305: 64.91,41.77 64.91,41.66 | IC3.10 66.91,47.37 66.05,47.37 65.66,46.98 65.66,46.23 64.77,45.34 | IC3.31 62.45,56.87 62.45,56.02 63.1,55.37 65.15,55.37 65.66,54.86 65.66,48.19 64.8,47.33 64.8,46.89 64.13,46.23 60.02,46.23 59.34,46.91 58.77,46.91 58.09,46.23 v57.02,46.23 | R6.2 68.49,24.16 70.23,25.91 70.23,35.05 70.22,35.05 67.27,38 65.76,38 64.93,38.83 IC3.100 64.93,45.21 64.93,45.44 64.9,45.47 | v56.16,45.89 56.84,45.21 64.64,45.21 64.77,45.34 | 64.77,45.34 | 65.15,45.72 64.77,45.34
  Top 0.508: C8.1 35.43,46.99 34.92,46.48 | 27.56,46.74 29.08,48.26 C6.1 | R6.2 R5.2
  Top 0.61: IC4.3 3.65,35.63 IC2.2 | R1.1 8.51,62.23 4.7,58.42 | v25.53,48.26 24,46.74 | C7.1 27.18,55.25 26.04,56.39 26.04,69.6 28.07,71.63 29.59,71.63 R4.1
  Top 0.813: BLE_FRIEND.5 100.71,89.41 105.28,84.84 105.28,83.82 106.05,83.06 HC05.5
  Top 1.016: IC1.2 C3.1 20.7,34.29 24,37.59 24,43.69 20.95,46.74 | 20.95,46.74 6.73,46.74 4.7,48.77 4.7,58.42 4.7,73.66 15.37,84.33 15.37,96.01 18.42,99.06 31.62,99.06 | 31.62,99.06 44.83,99.06 | R12.1 36.7,93.98 31.62,99.06 | R11.1 49.91,93.98 44.83,99.06 | 20.95,46.74 24,46.74 27.56,46.74 34.32,46.74 34.67,46.74 34.92,46.48 41.28,40.13 v50.42,40.13 | 44.83,99.06 53.47,99.06 | R10.1 58.55,93.98 53.47,99.06 | BLE_FRIEND.5 100.71,96.01 97.66,99.06 81.41,99.06 | 81.41,99.06 53.47,99.06 | PROGRAM.2 84.46,96.01 81.41,99.06
  Top 1.27: IC1.2 IC1.4
  Bottom 0.152: 54.99,38.14 v55,38.13
  Bottom 0.203: 54.31,43.86 v56.16,45.89
  Bottom 0.254: 54.99,38.14 54.99,43.18 54.31,43.86 | v47.83,49.95 51.77,49.95 52.45,49.28 52.45,42.67 52.7,42.43
  Bottom 0.305: 52.96,43 53.58,43.56 v56.16,45.89 56.5,46.23 v57.02,46.23
  Bottom 0.61: C7.1 25.53,51.69 v25.53,48.26
  Bottom 1.016: v50.42,40.13 50.42,40.15 52.7,42.43 v56.16,45.89
AREF  (via drill 0.35)
  Top 0.305: C9.1 37.34,57.79 38.23,56.9 v38.23,54.36 | v38.73,51.82 38.82,51.73 38.82,47.74 40.26,46.3 40.26,46.23 40.67,45.81 40.67,42.51 42.13,41.05 51.73,41.05 52.89,42.22 52.89,43.62 53.98,44.7 62.61,44.7 63.12,44.2 63.12,42.67 63.93,41.86 IC3.98
  Bottom 0.305: v38.73,51.82 38.73,53.05 38.53,53.25 38.53,54.05 v38.23,54.36
GND  (via drill 0.35, 0.41)
  Top 0.15: IC3.11 67.02,47.94 67.02,47.9
  Top 0.152: v53.56,31.43 53.53,31.4
  Top 0.254: IC3.81 55.43,43.11 56.52,44.2 57.87,44.2 v58.04,44.02 | IC3.11 65.97,47.9 65.23,47.16 65.23,46.41 64.59,45.77 59.51,45.77 v59.06,46.23 | 64.48,40.94 IC3.99 64.43,43.17 v64.01,43.59 | 50.91,49.37 50.05,49.37 49.98,49.3 47.5,49.3 46.72,50.08 46.72,50.76 | v55.06,35.97 v55.06,33.94 | 53.53,31.4 v50.48,31.4 | v64.67,50.17 64.67,50.32 65.23,50.88 65.23,54.28 64.64,54.86 63,54.86 61.98,55.89 61.98,56.85 IC3.32
  Top 0.305: 50.91,49.37 IC3.62 | 46.72,50.76 v46.85,50.88 | TMP102.6 52.2,29.21 53.47,27.94 v53.47,24.89 | v53.47,20.83 53.47,19.56 TMP102.1
  Top 0.61: 12.29,31.75 IC2.1 | 44.2,72.01 C10.1
  Top 1.016: C3.2 12.29,31.75
  Bottom 0.254: v58.04,44.02 58.37,44.02 59.06,44.7 v59.06,46.23 64.13,46.23 64.64,46.74 64.64,47.24 64.93,47.53 64.93,49.63 64.92,49.64 64.92,49.92 v64.67,50.17 | v55.06,33.94 55.06,32.92 v53.56,31.43 | v64.01,43.59 64.01,44.07 64.64,44.7
  Bottom 0.305: v46.85,50.88 46.86,50.87 46.86,48.7 49.34,46.23 49.34,38.96 50.7,37.59 54.48,37.59 55.06,37.02 v55.06,35.97 | v53.47,24.89 v53.47,20.83 | TMP102.1 50.42,14.19 v50.48,14.13
  Bottom 1.016: C2.2 C1.2 J1.GNDBREAK 7.24,18.3 v7.24,16.26 | v1.14,16.26 v3.17,16.26 v5.21,16.26 v7.24,16.26 | v7.24,16.26 v9.27,16.26 v11.3,16.26
  Bottom 1.27: J1.GNDBREAK J1.GND
  other vias: 69.22,47.75 84.01,81.18 85.53,81.18 108.39,95.41 110.93,95.41 60.64,88.3 26.1,36.99 23.05,14.13 91.12,22.76 97.73,23.78 97.73,45.12 91.12,44.1 90.11,64.42 97.22,65.44 37.27,55.28 32.7,51.21 20.51,48.67 22.48,59.44 29.08,59.34 94.68,41.05 94.17,31.4 109.92,44.1 102.3,63.4 93.66,62.39 95.19,19.21 111.38,35.56 102.24,41.66 46.93,66.45 59.12,66.45
  pour Bottom: -0.38,108.2 124.08,108.2 124.08,-1.02 -0.38,-1.02
  pour Top: -0.38,108.2 124.08,108.2 124.08,-1.02 -0.38,-1.02
N$2  (via drill 0.35)
  other vias: 105.79,19.3
N$3
  Top 0.61: R1.2 14.86,64.77 ON.A
N$4  (via drill 0.35)
  other vias: 110.59,25.46
N$5
  Bottom 0.203: Q3.1 102.74,26.8 LED1.1
N$6
  Bottom 0.203: Q4.1 104.01,48.01 LED2.1
N$7
  Top 0.203: LED3.1 95.38,68.33 Q2.1
N$8  (via drill 0.35)
  other vias: 111.32,20.7
N$10  (via drill 0.35)
  other vias: 103.25,29.97
PA0  (via drill 0.35, 0.41)
  Top 0.203: IC3.78 53.93,37.04 v53.47,36.58 | Q3.2 101.73,25.4 100.71,24.38 100.71,14.73 v102.24,13.21 | v104.78,9.14 103.76,8.13 51.44,8.13 50.67,7.37 PA.1
  Bottom 0.152: 48.39,15.75 48.39,15.24 48.9,14.73 48.9,8.13 50.2,8.13 50.67,7.65 PA.1
  Bottom 0.203: 48.39,15.75 48.39,30.99 49.91,32.51 51.94,32.51 53.47,34.04 v53.47,36.58 | v102.24,13.21 104.78,10.67 v104.78,9.14
PA1  (via drill 0.35, 0.41)
  Top 0.203: IC3.77 53.43,37.55 v52.45,36.58 | PA.2 48.13,8.38 48.39,8.64 101.85,8.64 101.97,8.51 102.62,8.51 v103.25,9.14 | v101.22,12.7 100.2,13.72 100.2,45.72 101.47,46.99 Q4.2
  Bottom 0.203: v52.45,36.58 52.45,34.54 50.93,33.02 48.9,33.02 47.37,31.5 47.37,15.24 48.13,14.48 PA.2 | v103.25,9.14 103.25,10.67 v101.22,12.7
PA2  (via drill 0.35, 0.41)
  Top 0.203: IC3.76 52.93,38.07 v51.44,36.58 | Q2.2 100.71,67.06 99.19,65.53 99.19,13.21 v100.2,12.19 | v102.24,9.14 46.86,9.14 45.59,7.87 PA.3
  Bottom 0.203: PA.3 45.59,7.37 46.86,8.64 46.86,32 48.9,34.04 50.42,34.04 51.44,35.05 v51.44,36.58 | v100.2,12.19 102.24,10.16 v102.24,9.14
PA3  (via drill 0.41)
  Top 0.203: IC3.75 46.58,42.9 v46.36,42.67
  Bottom 0.203: PA.4 43.05,5.84 46.36,9.14 v46.36,42.67
PA4  (via drill 0.41)
  Top 0.203: IC3.74 45.55,43.4 v45.34,43.18
  Bottom 0.203: v45.34,43.18 45.34,10.16 42.8,7.62 40.77,7.62 40.26,7.11 40.26,5.33 PA.5
PA5  (via drill 0.41)
  Top 0.203: IC3.73 45.04,43.9 v44.32,43.18
  Bottom 0.203: PA.6 37.97,6.86 39.75,8.64 42.29,8.64 44.32,10.67 v44.32,43.18
PA6  (via drill 0.41)
  Top 0.203: IC3.72 44.52,44.4 v43.31,43.18
  Bottom 0.203: v43.31,43.18 43.31,11.18 41.78,9.65 36.7,9.65 35.43,8.38 PA.7
PA7  (via drill 0.41)
  Top 0.203: IC3.71 44.01,44.9 v42.29,43.18
  Bottom 0.203: v42.29,43.18 42.29,12.7 40.26,10.67 33.66,10.67 32.89,9.91 PA.8
PB0  (via drill 0.41)
  Top 0.203: IC3.19 74.37,51.9 v78.87,56.39
  Bottom 0.203: PB.1 115.57,62.61 109.35,56.39 v78.87,56.39
PB1  (via drill 0.41)
  Top 0.203: IC3.20 73.86,52.4 v78.87,57.4 | PROGRAM.3 83.02,85.6 84.03,84.58 103,84.58 103.25,84.33 103.25,72.14 106.3,69.09 106.31,69.09 106.66,68.73 112.75,68.73 113.92,67.56 113.92,66.04 114.81,65.15 PB.2
  Bottom 0.203: PB.2 115.06,65.15 113.41,63.5 113.41,61.47 109.35,57.4 v78.87,57.4
PB2  (via drill 0.41)
  Top 0.203: IC3.21 73.34,52.9 v78.87,58.42 | PROGRAM.4 102.49,85.6 103.76,84.33 103.76,72.14 106.81,69.09 113.41,69.09 114.94,67.56 117.35,67.56 PB.3
  Bottom 0.203: PB.3 115.57,67.69 112.4,64.52 112.4,61.98 108.84,58.42 v78.87,58.42
PB3  (via drill 0.35)
  Top 0.152: IC3.22 72.91,53.4 v78.87,59.36
  Top 0.203: PB.4 106.68,70.23 104.27,72.64 104.27,84.84 102.74,86.36 85.98,86.36 85.22,87.12 84.03,87.12 83.02,88.14 PROGRAM.1
  Bottom 0.152: PB.4 111.89,64.64 111.89,61.98 108.84,58.93 82.42,58.93 81.91,59.44 78.95,59.44 v78.87,59.36
PB4  (via drill 0.35)
  Top 0.152: IC3.23 72.31,53.9 v78.87,60.45
  Bottom 0.152: v78.87,60.45 81.91,60.45 82.93,59.44 108.33,59.44 111.38,62.48 111.38,70.61 113.54,72.77 PB.5
PB5  (via drill 0.35)
  Top 0.152: IC3.24 71.79,54.4 v78.87,61.47
  Top 0.203: v78.87,61.47 80.9,61.47 81.41,60.96 81.41,52.22 81.27,52.08 81.27,50.92 v81.9,50.29 | v83.97,42.67 83.97,29.95 85.98,27.94 88.39,27.94 SERV01.1
  Bottom 0.152: v78.87,61.47 81.91,61.47 83.44,59.94 107.82,59.94 110.87,62.99 110.87,73.15 112.9,75.18 117.35,75.18 PB.6
  Bottom 0.203: v81.9,50.29 82.42,50.29 83.95,48.77 83.95,42.69 v83.97,42.67
PB6  (via drill 0.35)
  Top 0.152: IC3.25 71.28,54.9 78.76,62.37 v78.93,62.37
  Top 0.203: v78.93,62.37 81.52,62.37 81.91,61.98 81.91,51.84 v81.9,51.82
  Bottom 0.152: PB.7 114.05,77.85 109.86,73.66 109.86,62.99 107.31,60.45 83.95,60.45 82.03,62.37 v78.93,62.37
  Bottom 0.203: v81.9,51.82 84.31,49.4 SERV02.1
PB7  (via drill 0.35)
  Top 0.152: IC3.26 64.93,58.2 v67.69,60.96 | PB.8 119.4,82.32 119.4,90.52 120.62,91.74 v120.62,100.08
  Top 0.203: v79.57,63.31 77.34,63.31 75.63,65.02 v71.25,65.02
  Bottom 0.152: 117.6,80.26 PB.8 | v120.62,100.08 120.62,104.04 119.51,105.16 87,105.16 77.85,96.01 74.3,96.01 73.28,95 73.28,66.04 68.2,60.96 v67.69,60.96
  Bottom 0.203: SERV03.1 80.52,64.26 v79.57,63.31 | v67.69,60.96 67.69,61.47 v71.25,65.02
PC0  (via drill 0.41)
  Top 0.203: IC3.53 49.86,53.9 47.37,56.39 47.37,56.9 v46.36,57.91
  Bottom 0.152: v46.36,57.91 47.37,56.9 47.37,56.39 49.91,53.85 52.45,53.85 52.96,54.36 65.15,54.36 66.68,55.88 66.68,57.4 74.8,65.53 74.8,93.98 75.31,94.49 79.38,94.49 80.9,96.01 80.9,96.52 84.46,100.08 88.01,100.08 88.52,100.58 PC.1
PC1  (via drill 0.41)
  Top 0.203: IC3.54 49.86,53.4 v46.36,56.9
  Bottom 0.152: v46.36,56.9 49.91,53.34 51.5,53.34 51.62,53.47 52.58,53.47 52.96,53.85 65.15,53.85 67.18,55.88 67.18,57.4 75.31,65.53 75.31,93.47 75.82,93.98 79.88,93.98 81.41,95.5 81.41,96.52 84.46,99.57 89.53,99.57 91.06,101.09 PC.2
PC2  (via drill 0.4)
  Top 0.203: IC3.55 52.39,52.9 v52.45,52.83
  Bottom 0.203: v52.45,52.83 52.96,53.34 65.15,53.34 67.69,55.88 67.69,57.4 75.82,65.53 75.82,92.96 76.33,93.47 79.88,93.47 81.91,95.5 81.91,96.52 84.46,99.06 93.09,99.06 93.6,99.57 PC.3
PC3  (via drill 0.41)
  Top 0.203: IC3.56 49.84,52.4 v46.36,55.88
  Bottom 0.152: 80.39,92.96 76.84,92.96 76.33,92.46 76.33,65.53 68.2,57.4 68.2,55.88 65.15,52.83 53.4,52.83 52.7,52.13 52.23,52.13 51.98,52.39 49.85,52.39 v46.36,55.88
  Bottom 0.203: PC.4 96.14,99.57 95.12,98.55 84.46,98.55 82.42,96.52 82.42,95 80.39,92.96
PC4  (via drill 0.41)
  Top 0.203: IC3.57 49.32,51.9 v46.36,54.86
  Bottom 0.203: PC.5 98.68,99.06 97.66,98.04 84.96,98.04 82.93,96.01 82.93,94.49 80.9,92.46 77.34,92.46 76.84,91.95 76.84,65.53 68.71,57.4 68.71,55.88 65.15,52.32 53.47,52.32 52.86,51.72 52.07,51.72 51.98,51.82 49.4,51.82 v46.36,54.86
PC5  (via drill 0.41)
  Top 0.203: IC3.58 48.81,51.4 v46.36,53.85
  Bottom 0.203: v46.36,53.85 48.9,51.31 52.96,51.31 53.47,51.82 65.15,51.82 69.22,55.88 69.22,57.4 77.34,65.53 77.34,91.44 77.85,91.95 81.41,91.95 83.44,93.98 83.44,95.5 85.47,97.54 100.2,97.54 101.22,98.55 PC.6
PC6  (via drill 0.41)
  Top 0.203: IC3.59 48.29,50.9 v46.36,52.83
  Bottom 0.203: PC.7 103.76,98.55 102.24,97.03 85.98,97.03 84.46,95.5 84.46,94.49 81.41,91.44 78.36,91.44 77.85,90.93 77.85,65.53 69.72,57.4 69.72,55.88 65.15,51.31 53.46,51.31 53.11,50.95 48.75,50.95 46.87,52.83 v46.36,52.83
PC7  (via drill 0.41)
  Top 0.152: 46.87,51.82 48.22,50.47 50.24,50.47 | IC3.60 50.46,50.4 50.39,50.32
  Top 0.203: v46.36,51.82 46.87,51.82 | 50.39,50.32 50.24,50.47
  Bottom 0.203: PC.8 106.3,98.04 104.78,96.52 85.98,96.52 84.96,95.5 84.96,94.49 81.41,90.93 78.87,90.93 78.36,90.42 78.36,65.53 70.23,57.4 70.23,55.88 65.15,50.8 53.47,50.8 53.21,50.55 48.13,50.55 47.88,50.8 | v46.36,51.82 46.86,51.82 47.88,50.8 | 47.88,50.8 47.89,50.8
PD0  (via drill 0.3, 0.35, 0.41)
  Top 0.15: v47.97,39.05 52.26,34.77 | v44.32,49.21 44.32,58.9 46.07,60.64 47.81,60.64 52.58,55.88 56.23,55.88 56.39,56.04 56.39,56.83 IC3.43 | 52.26,24.13
  Top 0.152: 52.26,34.77 55.5,31.53 55.5,26.42 57.77,24.15 58.04,24.15 | TMP102.4 48.56,24.13 41.93,30.76 41.93,38.41 34.85,45.49 v32.64,45.49
  Top 0.203: IC3.43 56.43,62.4 57.02,62.99 57.02,65.53 v55.5,67.06 | MPU.3 6.22,84.17 8.35,86.29 8.35,100.17 9.78,101.6 48.9,101.6 49.91,100.58 v51.94,100.58 | R6.1 58.04,24.15 52.26,24.13 TMP102.4
  Bottom 0.15: v47.97,39.05 47.02,40.01 47.02,46.51 v44.32,49.21
  Bottom 0.152: MPU.3 6.22,83.44 3.89,81.11 | 4.13,81.34 3.17,80.39 3.17,47.24 5.03,45.39 23.83,45.39 23.93,45.49 v32.64,45.49
  Bottom 0.203: v55.5,67.06 49.91,72.64 49.91,99.57 52.45,102.11 52.96,102.11 | 52.96,102.11 53.47,102.11 53.85,102.49 PD.1 | v51.94,100.58 52.96,101.6 52.96,102.11
PD1  (via drill 0.35, 0.41)
  Top 0.15: 41.62,30.64 50.36,21.91 50.36,21.59 TMP102.3
  Top 0.152: 41.62,30.64 41.62,38.28 40.06,39.85 40.03,39.85 35,44.88 32.64,44.88 30.94,43.18 v25.53,43.18 | v21.97,43.18 19.15,46 6.43,46 3.97,48.46 3.97,73.96 8.26,78.25 8.26,81.79 7.24,82.8 4.19,82.8 3.17,83.82 3.17,85.34 4.19,86.36 MPU.4 4.7,86.36
  Top 0.203: v55.5,66.04 55.5,65.53 56.52,64.52 56.52,62.99 55.93,62.41 IC3.44 | v49.91,102.11 9.78,102.11 8,100.33 8,88.14 MPU.4 | TMP102.3 50.45,21.62 R5.1
  Bottom 0.152: v25.53,43.18 v21.97,43.18
  Bottom 0.203: PD.2 51.31,101.98 50.93,101.6 | 50.93,101.6 49.4,100.08 49.4,72.14 v55.5,66.04 | v49.91,102.11 50.42,102.11 50.93,101.6
PD2  (via drill 0.41)
  Top 0.203: IC3.45 55.43,62.92 56.01,63.5 56.01,64.01 v53.98,66.04
  Bottom 0.203: v53.98,66.04 48.9,71.12 48.9,104.01 PD.3
PD3  (via drill 0.41)
  Top 0.203: IC3.46 54.93,63.95 v54.99,64.01
  Bottom 0.203: PD.4 47.88,102.49 47.88,71.12 v54.99,64.01
PD4  (via drill 0.41)
  Top 0.203: IC3.47 54.43,63.55 v53.47,64.52
  Bottom 0.203: PD.5 43.69,102.87 39.88,99.06 27.18,99.06 25.27,97.16 25.27,66.04 25.91,65.41 52.58,65.41 v53.47,64.52
PD5  (via drill 0.41)
  Top 0.203: IC3.48 53.93,62.79 53.21,63.5 v52.96,63.5
  Bottom 0.203: PD.6 36.7,99.7 27.18,99.7 24.51,97.03 24.51,65.53 25.78,64.27 45.1,64.27 45.19,64.36 50.86,64.36 51.27,64.77 51.69,64.77 v52.96,63.5
PD6  (via drill 0.41)
  Top 0.203: v51.44,64.01 53.43,62.02 IC3.49
  Bottom 0.203: PD.7 38.61,102.23 36.7,100.33 27.18,100.33 24,97.16 24,65.41 25.5,63.91 45.24,63.91 45.34,64.01 v51.44,64.01 51.34,63.91
PD7  (via drill 0.35)
  Top 0.203: IC3.50 52.93,60.61 50.26,63.28 v50.08,63.28
  Bottom 0.15: 50.04,63.5 50.04,63.34 v50.08,63.28
  Bottom 0.203: PD.8 32.89,100.97 27.18,100.97 23.37,97.16 23.37,65.41 25.27,63.5 50.04,63.5
PE0  (via drill 0.35, 0.41)
  Top 0.203: IC3.2 70.52,43.4 v76.33,37.59 | v103.88,90.93 102.62,89.67 v102.62,88.9 | HC05.3 109.09,77.98 109.86,78.74 109.86,86.87 105.79,90.93 BLE_FRIEND.3
  Bottom 0.203: PE.1 114.43,12.19 108.33,18.29 108.33,27.43 102.24,33.53 80.39,33.53 v76.33,37.59 74.8,39.12 74.8,42.67 77.34,45.21 77.34,62.48 87,72.14 | BLE_FRIEND.3 103.88,91.05 v103.88,90.93 | v102.62,88.9 102.62,74.55 100.71,72.64 87.5,72.64 87,72.14 | 87,72.14 84.2,74.93 JP2.1
PE1  (via drill 0.35, 0.41)
  Top 0.152: JP2.2 82.68,77.47 v88.52,71.63
  Top 0.203: IC3.3 71.04,43.9 v75.82,39.12
  Bottom 0.152: v88.52,71.63 88.01,72.14
  Bottom 0.203: PE.2 113.92,14.73 108.84,19.81 108.84,27.94 102.74,34.04 80.9,34.04 v75.82,39.12 76.18,39.47 76.18,43.45 77.85,45.13 77.85,62.48 87.5,72.14 88.01,72.14 100.71,72.14 103.25,74.68 BLE_FRIEND.4
PE2  (via drill 0.41)
  Top 0.203: IC3.4 71.56,44.4 v77.34,38.61
  Bottom 0.203: v77.34,38.61 81.41,34.54 102.74,34.54 109.86,27.43 109.86,20.83 113.41,17.27 PE.3 116.84,16.76
PE3  (via drill 0.41)
  Top 0.203: IC3.5 72.07,44.9 v79.38,37.59
  Bottom 0.203: v79.38,37.59 81.91,35.05 103.76,35.05 111.38,27.43 111.38,22.35 113.92,19.81 PE.4
PE4  (via drill 0.41)
  Top 0.203: IC3.6 72.59,45.4 v77.85,40.13
  Bottom 0.203: v77.85,40.13 82.42,35.56 104.78,35.56 111.89,28.45 111.89,23.88 113.41,22.35 PE.5
PE5  (via drill 0.41)
  Top 0.203: IC3.7 73.1,45.9 v77.85,41.15
  Bottom 0.203: v77.85,41.15 82.93,36.07 105.79,36.07 112.9,28.96 112.9,25.4 113.41,24.89 PE.6
PE6  (via drill 0.41)
  Top 0.203: IC3.8 73.62,46.4 v76.84,43.18
  Bottom 0.203: v76.84,43.18 83.44,36.58 106.81,36.58 113.92,29.46 113.92,28.45 114.94,27.43 PE.7
PE7  (via drill 0.41)
  Top 0.203: IC3.9 74.14,46.9 v78.87,42.16
  Bottom 0.203: v78.87,42.16 83.95,37.08 107.82,37.08 114.94,29.97 PE.8
PF0  (via drill 0.35, 0.41)
  Top 0.203: IC3.97 63.43,39.31 65.15,37.59 66.68,37.59 v69.22,35.05 | R13.2 64.9,69.85 v75.14,59.61
  Top 0.254: R10.2 64.9,93.76 R13.2
  Bottom 0.203: PF.1 101.22,5.08 101.22,8.13 95.63,13.72 88.52,13.72 69.22,33.02 v69.22,35.05 66.68,37.59 65.15,37.59 63.63,39.12 63.63,41.66 64.13,42.16 65.66,42.16 66.17,42.67 66.17,50.32 74.86,59.01 74.86,59.33 v75.14,59.61
PF1  (via drill 0.35, 0.41)
  Top 0.203: IC3.96 62.93,38.8 64.64,37.08 66.17,37.08 v68.2,35.05 | R14.2 57.53,85.85 63.63,85.85 64.54,84.94 64.54,69.7 73.79,60.46 73.79,59.88 v74.23,59.44
  Top 0.254: R11.2 55.25,93.76 R14.2
  Bottom 0.203: PF.2 98.55,9.27 95.12,12.7 88.52,12.7 68.2,33.02 v68.2,35.05 66.17,37.08 64.64,37.08 63.12,38.61 63.12,41.66 63.98,42.52 65,42.52 65.66,43.18 65.66,50.31 70.94,55.59 70.94,56.14 v74.23,59.44
PF2  (via drill 0.35, 0.41)
  Top 0.203: IC3.95 62.43,38.79 64.64,36.58 65.66,36.58 v67.18,35.05 | R15.2 48.39,85.34 63.12,85.34 64.13,84.33 64.13,69.6 73.28,60.45 v73.28,59.44
  Top 0.254: R12.2 45.56,88.17 R15.2
  Bottom 0.203: PF.3 96.14,5.08 96.14,9.65 93.6,12.19 87.5,12.19 67.18,32.51 v67.18,35.05 65.66,36.58 64.64,36.58 62.61,38.61 62.61,41.66 63.83,42.87 64.84,42.87 65.31,43.34 65.31,49.78 65.3,49.79 65.3,50.45 70.58,55.73 70.58,56.74 v73.28,59.44
PF3  (via drill 0.41)
  Top 0.203: IC3.94 61.93,38.78 64.64,36.07 65.66,36.07 66.17,35.56 v66.17,35.05
  Bottom 0.203: v66.17,35.05 66.17,32.51 87.25,11.43 90.81,11.43 93.47,8.76 PF.4 93.47,5.21
PF4  (via drill 0.41)
  Top 0.203: IC3.93 61.43,38.77 v65.15,35.05
  Bottom 0.203: v65.15,35.05 65.15,32.51 87.5,10.16 90.04,10.16 90.93,9.27 PF.5 90.93,6.73
PF5  (via drill 0.41)
  Top 0.203: IC3.92 60.93,38.77 64.13,35.56 v64.13,35.05
  Bottom 0.203: v64.13,35.05 64.13,32.51 88.39,8.25 PF.6
PF6  (via drill 0.41)
  Top 0.203: IC3.91 60.43,38.25 60.58,38.1 61.09,38.1 63.12,36.07 v63.12,35.05
  Bottom 0.203: v63.12,35.05 63.12,32 85.85,9.27 PF.7
PF7  (via drill 0.41)
  Top 0.203: IC3.90 59.93,38.24 60.58,37.59 61.09,37.59 62.1,36.58 v62.1,35.05
  Bottom 0.203: PF.8 83.31,10.79 62.1,32 v62.1,35.05
PG0  (via drill 0.41)
  Top 0.203: IC3.51 49.88,54.9 48.39,56.39 48.39,57.91 v46.36,59.94
  Bottom 0.152: v46.36,59.94 48.39,57.91 48.39,56.39 49.91,54.86 52.45,54.86 52.96,55.37 65.15,55.37 65.66,55.88 65.66,57.91 73.79,66.04 73.79,95 74.3,95.5 78.36,95.5 87.5,104.65 119.51,104.65 120.02,104.14 120.02,98.55 119.25,97.79 PG.1
PG1  (via drill 0.41)
  Top 0.203: IC3.52 49.87,54.4 47.88,56.39 47.88,57.4 v46.36,58.93
  Bottom 0.152: v46.36,58.93 47.88,57.4 47.88,56.39 49.91,54.36 52.45,54.36 52.96,54.86 65.15,54.86 66.17,55.88 66.17,57.91 74.3,66.04 74.3,94.49 74.8,95 78.87,95 88.01,104.14 115.95,104.14 116.46,103.63 116.46,101.09 114.94,99.57 114.94,96.01 115.7,95.25 PG.2
PG2  (via drill 0.35, 0.41)
  Top 0.152: v31.27,6.32 30.24,5.29 v30.24,4.08 | v120.31,88.9 v120.31,86.87
  Top 0.203: IC3.70 43.49,45.4 v42.29,44.2
  Bottom 0.152: 32.13,7.62 32.13,7.17 v31.27,6.32 | v30.24,4.08 31.78,2.54 57.53,2.54 58.04,3.05 115.95,3.05 120.02,7.11 120.02,56.47 120.32,56.77 120.32,83.95 120.31,83.96 v120.31,86.87 | PG.3 119.25,92.71 121.16,90.8 121.16,90.14 120.31,89.29 v120.31,88.9
  Bottom 0.203: 43.31,45.21 v42.29,44.2 41.28,43.18 41.28,12.7 39.75,11.18 32.64,11.18 32.13,10.67 32.13,7.62
PG3  (via drill 0.35)
  Top 0.152: IC3.28 63.93,59.51 v66.79,62.37 | v121.63,101.09 121.63,99.5 121.83,99.31 121.83,98.81 121.54,98.52 121.54,91.38 v120.56,90.39
  Bottom 0.152: v66.79,62.37 v66.79,62.38 71.88,67.47 71.88,95.63 73.79,97.54 78.36,97.54 86.69,105.87 119.81,105.87 121.63,104.04 v121.63,101.09 | PG.4 120.33,90.17 v120.56,90.39
PG4  (via drill 0.35)
  Top 0.152: v66.87,63.31 66.29,62.73 63.43,59.87 IC3.29
  Bottom 0.152: v66.87,63.31 71.58,68.02 71.58,96.34 73.28,98.04 78.36,98.04 86.49,106.17 120.02,106.17 122.05,104.14 122.05,101.53 122.24,101.34 122.24,100.84 122.05,100.65 122.05,89.41 120.27,87.63 PG.5
PG5  (via drill 0.4)
  Top 0.203: IC3.1 70.01,42.9 v75.31,37.59
  Bottom 0.152: 119.51,53.34 119.51,56.39 120.02,56.9 120.02,83.82 118.75,85.09 PG.6
  Bottom 0.203: 119.51,53.34 119.51,11.18 119,10.67 113.92,10.67 107.31,17.27 107.31,27.43 101.73,33.02 79.88,33.02 v75.31,37.59
PH0  (via drill 0.41)
  Top 0.203: IC3.12 73.65,48.4 v78.87,43.18
  Bottom 0.203: PH.1 84.46,37.59 v78.87,43.18
PH1  (via drill 0.41)
  Top 0.203: IC3.13 74.17,48.9 v78.87,44.2
  Bottom 0.203: PH.2 114.43,40.13 112.4,38.1 84.96,38.1 v78.87,44.2
PH2  (via drill 0.41)
  Top 0.203: IC3.14 74.68,49.4 v78.87,45.21
  Bottom 0.203: PH.3 115.95,42.67 111.89,38.61 85.47,38.61 v78.87,45.21
PH3  (via drill 0.41)
  Top 0.203: IC3.15 75.71,49.9 v81.41,44.2
  Bottom 0.203: PH.4 117.35,45.09 111.38,39.12 86.49,39.12 v81.41,44.2
PH4  (via drill 0.41)
  Top 0.203: IC3.16 75.92,50.4 v78.87,53.34
  Bottom 0.203: PH.5 114.43,47.75 110.87,51.31 110.87,52.83 110.36,53.34 v78.87,53.34
PH5  (via drill 0.41)
  Top 0.203: IC3.17 75.41,50.9 v78.87,54.36
  Bottom 0.203: v78.87,54.36 110.36,54.36 111.38,53.34 111.38,51.82 112.9,50.29 PH.6
PH6  (via drill 0.41)
  Top 0.203: IC3.18 74.89,51.4 v78.87,55.37
  Bottom 0.203: PH.7 112.9,52.83 110.36,55.37 v78.87,55.37
PH7  (via drill 0.35)
  Top 0.152: IC3.27 64.43,59.16 v66.71,61.44 | PH.8 117.98,55.37 119.7,57.09 119.7,90.39 121.22,91.92 v121.22,99.06
  Bottom 0.152: 67.04,61.77 72.18,66.91 72.18,95.42 73.99,97.23 78.56,97.23 86.9,105.57 119.6,105.57 121.03,104.14 121.03,100.52 121.22,100.33 v121.22,99.06 | v66.71,61.44 67.04,61.77 | 67.04,61.77
PJ0  (via drill 0.35)
  Top 0.203: IC3.63 47.37,48.9 46.34,49.92 46.34,49.93 v45.91,50.36
  Bottom 0.203: PJ.1 29.72,103.5 28.45,102.23 26.54,102.23 22.1,97.79 22.1,65.41 24.64,62.87 43.05,62.87 45.59,60.33 45.59,50.68 v45.91,50.36
PJ1  (via drill 0.35)
  Top 0.152: 45.86,49.53 45.85,49.53
  Top 0.203: IC3.64 47.37,48.4 47.36,48.4 46.99,48.4 45.86,49.53 | 45.85,49.53 v44.96,50.42
  Bottom 0.203: PJ.2 21.46,98.42 21.46,64.77 24,62.23 42.42,62.23 44.96,59.69 44.96,50.8 v44.96,50.42
PJ2  (via drill 0.35)
  Top 0.203: IC3.65 46.59,47.9 v45.47,48.99
  Bottom 0.203: PJ.3 24.64,102.87 20.83,99.06 20.83,64.13 23.37,61.59 41.78,61.59 44.32,59.05 44.32,50.16 v45.47,48.99
PJ3  (via drill 0.41)
  Top 0.203: IC3.66 45.19,47.4 v44.32,48.26
  Bottom 0.203: v44.32,48.26 43.69,48.9 43.69,58.42 41.15,60.96 22.73,60.96 20.19,63.5 20.19,99.7 22.1,101.6 PJ.4
PJ4  (via drill 0.41)
  Top 0.203: IC3.67 44.42,46.9 v43.05,48.26
  Bottom 0.203: PJ.5 19.56,63.5 22.73,60.33 40.51,60.33 43.05,57.79 v43.05,48.26
PJ5  (via drill 0.41)
  Top 0.203: IC3.68 50.89,46.36 43.69,46.36 v42.8,47.24
  Bottom 0.203: v42.8,47.24 6.6,47.24 5.59,48.26 5.59,73.66 5.72,73.66 13.34,81.28 13.21,81.41 13.21,100.97 13.84,101.6 16.38,101.6 17.02,102.23 PJ.6
PJ6  (via drill 0.41)
  Top 0.203: IC3.69 42.97,45.9 v42.8,45.72
  Bottom 0.203: v42.8,45.72 39.24,45.72 38.23,46.74 6.22,46.74 4.7,48.26 4.7,73.66 12.83,81.79 12.83,101.09 14.35,102.62 14.35,104.01 PJ.7
PJ7  (via drill 0.35)
  Top 0.152: v54.36,35.05 54.36,36.82 54.36,38.48 54.48,38.61 54.48,40.84 IC3.79
  Bottom 0.152: v54.36,35.05 54.36,33.91 52.45,32 52.45,4.06 51.44,3.05 32.13,3.05 30.85,4.33 | 40.77,42.67 37.21,46.23 6.27,46.23 4.19,48.3 4.19,73.66 12.32,81.79 12.32,102.11 11.81,102.62 11.81,104.01 PJ.8 | 30.85,4.33 | 30.85,4.33 30.64,4.53 30.64,6.58
  Bottom 0.203: 30.64,6.58 31.62,7.56 31.62,10.67 32.64,11.68 39.24,11.68 40.77,13.21 40.77,42.67
PK0  (via drill 0.41)
  Top 0.203: IC3.89 59.43,38.23 v61.09,36.58
  Bottom 0.203: PK.1 76.45,11.05 73.79,13.72 64.64,13.72 61.09,17.27 61.09,32 61.59,32.51 61.59,34.04 61.09,34.54 v61.09,36.58
PK1  (via drill 0.41)
  Top 0.203: IC3.88 58.93,37.72 60.58,36.07 v60.58,33.53
  Bottom 0.203: PK.2 73.91,9.52 70.74,12.7 64.64,12.7 60.58,16.76 v60.58,33.53
PK2  (via drill 0.41)
  Top 0.203: IC3.87 58.43,37.2 59.78,35.85 v59.78,34.13
  Bottom 0.203: v59.78,34.13 59.78,16.03 64.13,11.68 68.71,11.68 71.25,9.14 71.25,5.21 PK.3
PK3  (via drill 0.41)
  Top 0.203: IC3.86 57.93,37.2 59.06,36.07 v59.06,35.05
  Bottom 0.203: PK.4 68.83,8.51 66.68,10.67 63.63,10.67 59.06,15.24 v59.06,35.05
PK4  (via drill 0.41)
  Top 0.203: IC3.85 57.43,36.68 v58.04,36.07
  Bottom 0.203: v58.04,36.07 58.04,14.73 63.12,9.65 64.64,9.65 66.17,8.13 66.17,5.21 PK.5
PK5  (via drill 0.41)
  Top 0.203: IC3.84 56.93,36.16 v57.02,36.07
  Bottom 0.203: PK.6 63.75,6.98 57.02,13.72 v57.02,36.07
PK6  (via drill 0.35)
  Top 0.152: v56.39,35.05 56.39,35.8 56.39,35.81 56.39,40.86 IC3.83
  Bottom 0.152: 61.21,8 61.21,9.06 56.39,13.88 v56.39,35.05
  Bottom 0.203: PK.7 61.21,8
PK7  (via drill 0.35)
  Top 0.203: IC3.82 55.93,35.48 55.76,35.31 55.76,34.79 56.01,34.55 56.01,33.53 55.79,33.31 v55.79,32.51
  Bottom 0.203: PK.8 58.67,11.14 56.06,13.75 56.06,32.23 v55.79,32.51
PL0  (via drill 0.41)
  Top 0.203: IC3.35 60.43,57.76 v65.66,62.99
  Bottom 0.203: PL.1 78.61,103.38 76.84,101.6 72.26,101.6 70.23,99.57 70.23,99.06 71.25,98.04 71.25,68.58 v65.66,62.99
PL1  (via drill 0.41)
  Top 0.203: IC3.36 59.93,58.28 v64.13,62.48
  Bottom 0.203: PL.2 74.04,102.11 72.26,102.11 69.72,99.57 69.72,99.06 70.74,98.04 70.74,69.09 v64.13,62.48
PL2  (via drill 0.41)
  Top 0.203: IC3.37 59.43,58.79 v62.61,61.98
  Bottom 0.203: PL.3 69.22,99.82 69.22,99.06 70.23,98.04 70.23,69.6 v62.61,61.98
PL3  (via drill 0.41)
  Top 0.203: IC3.38 58.93,59.31 v63.63,64.01
  Bottom 0.203: PL.4 68.71,101.85 68.71,98.55 69.72,97.54 69.72,70.61 63.63,64.52 v63.63,64.01
PL4  (via drill 0.41)
  Top 0.203: IC3.39 58.43,59.83 v62.1,63.5
  Bottom 0.203: PL.5 68.2,103.89 68.2,98.55 69.22,97.54 69.22,70.61 v62.1,63.5
PL5  (via drill 0.41)
  Top 0.203: IC3.40 57.93,60.34 v60.58,62.99
  Bottom 0.203: PL.6 65.66,103.89 65.66,100.58 68.71,97.54 68.71,71.12 v60.58,62.99
PL6  (via drill 0.41)
  Top 0.203: IC3.41 57.43,60.86 v58.04,61.47
  Bottom 0.203: PL.7 63.63,103.89 63.63,102.11 68.2,97.54 68.2,71.63 v58.04,61.47
PL7  (via drill 0.41)
  Top 0.203: IC3.42 56.93,61.88 v57.53,62.48
  Bottom 0.203: PL.8 67.69,97.28 67.69,72.64 v57.53,62.48
POWERIN
  Top 1.27: JP1.1 15.62,7.37 14.35,8.64 14.35,24.48 14.2,24.63
  Top 1.778: J1.PWR 14.2,24.63 D1.A
RESET  (via drill 0.35)
  Top 0.15: 43.21,68.2 43.21,68.26 43.31,68.2
  Top 0.254: IC3.30 62.93,58.32 v62.82,58.42
  Top 0.305: 41.78,62.99 39.5,65.28 RESET.4 43.21,68.2 43.31,68.2 43.69,68.2 | 41.78,62.99 49.4,62.99 v50.42,61.98 | 41.78,62.99 36.77,62.99 33.91,65.85 RESET.3 30.73,68.2 R4.2 | 43.69,68.2 C10.2 | 43.69,68.2 61.6,68.2 v63.5,70.1 | v66.68,73.15 76.58,83.06 PROGRAM.5
  Bottom 0.254: 52.96,59.44 62.65,59.44 62.82,59.27 v62.82,58.42
  Bottom 0.305: 53.47,58.93 52.96,59.44 v50.42,61.98 | v63.5,70.1 63.63,70.1 v66.68,73.15
VCC  (via drill 0.35)
  Top 0.15: IC2.3 12.41,36.67 IC1.3
  Top 1.016: C13.1 IC5.1
  Top 1.27: v17.4,36.58 17.37,36.6 IC1.3
  Bottom 1.016: C14.1 31.62,14.22 29.08,11.68 IC6.1 | IC5.1 29.97,31.37 27.81,29.21
  Bottom 1.27: IC6.1 21.21,11.68 C2.1 C1.1 23.24,19.05 27.81,23.62 D1.C 27.81,29.21 20.45,36.58 v17.4,36.58
XTAL1
  Top 0.152: Y1.3 11.37,52.14 R2.2
  Top 0.203: 19.43,52.14 Y1.3 | 19.43,52.14 22.03,52.14 C4.1 | Q1.2 17.99,50.8 arc45 18.17,50.87 19.43,52.14
  Top 0.305: C4.1 24.13,52.83 39.75,52.83 40.51,52.07 R3.1
XTAL1R
  Top 0.305: R3.2 41.58,47.7 41.58,42.89 42.51,41.96 51.35,41.96 51.98,42.59 51.98,51.36 53.16,52.54 53.16,54.05 53.98,54.86 60.07,54.86 60.93,55.72 IC3.34
XTAL2  (via drill 0.41)
  Top 0.152: R2.1 16.31,54.61 Y1.1
  Top 0.203: Y1.1 19.43,54.54 | 19.43,54.54 22.03,54.54 C5.1 | Q1.1 17.99,55.88 arc-45 18.17,55.81 19.43,54.54
  Top 0.254: 53.61,53.85 54.2,54.44 60.66,54.44 61.43,55.2 IC3.33
  Top 0.305: v39.24,53.54 24.44,53.54 C5.1 | v39.53,48.04 39.89,48.04 40.11,47.8 40.71,47.8 41.13,47.39 41.13,42.7 42.32,41.51 51.54,41.51 52.44,42.41 52.44,51.18 53.61,52.35 53.61,53.85
  Bottom 0.305: v39.24,53.54 39.53,53.26 v39.53,48.04

### Text on the board
tNames: PL7 | PJ7 | PJ6 | PJ5 | PJ4 | PJ3 | PJ2 | PJ1 | PJ0 | PD7 | PD6 | PD5 | PD4 | PD3 | PD2 | PD1 | PD0 | PL6 | PL5 | PL4 | PL3 | PL2 | PL1 | PL0 | PC0 | PC1 | PC2 | PC3 | PC4 | PC5 | PC6 | PC7 | PG0 | INT | GND | PG1 | PLGS | PG2 | XCL | PG3 | XDA | DFU | GND | RTS | VIN | RX | TX | GND | GND | PG4 | SDA | EN | PG5 | SCL | VIN | GND | Sarah Africa / Joshua Perry / Luis Ruiz | GND | PB7 | VIN | TX | PB6 | TX | RX | GND | RX | PB5 | GND | GND | STATE | PB4 | PB3 | E | B | PB2 | PB1 | GND | C | PB0 | GND | GND | PH7 | GND | PH6 | GND | E | PH5 | GND | PH4 | B | C | PH3 | GND | GND | GND | PH2 | GND | PH1 | PH0 | GND | GND | GND | GND | PE7 | E | ALT | PE6 | B | PE5 | SCL | GND | C | GND | SDA | PE4 | GND | PE3 | VIN | GND | PE2 | PE1 | GND | PE0 | GND | GND | VIN | PA7 | PA6 | PA5 | PA4 | PA3 | PA2 | PA1 | PA0 | PK7 | PK6 | PK5 | PK4 | PK3 | PK2 | PK1 | PK0 | PF7 | PF6 | PF5 | PF4 | PF3 | PF2 | PF1 | PF0